# Altium schematic sheet obc-v2_FRAM-FLASH.SchDoc
size 420 x 297 mm; SheetNumber: 8; SheetTotal: 23
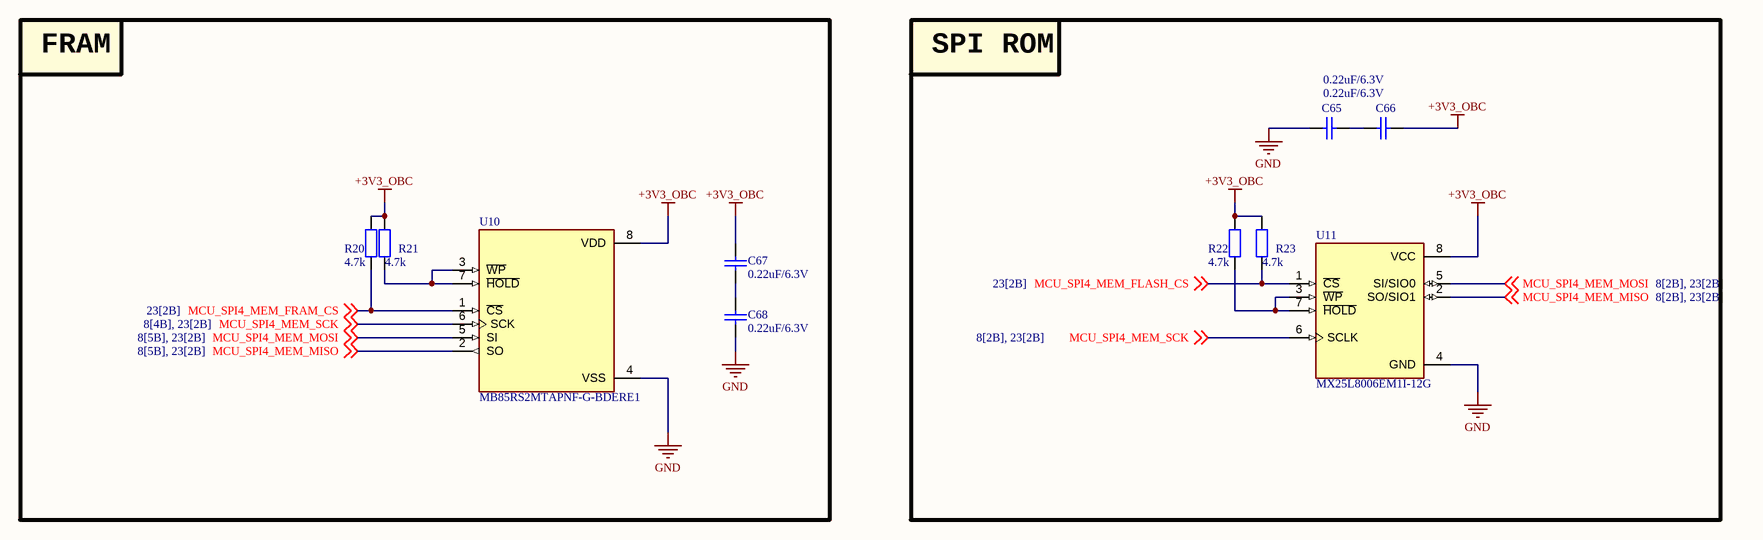
[diagram p0: obc-v2_FRAM-FLASH.SchDoc]

## Parts
C65  0.22uF/6.3V  [CAP_C_1005X60]
C66  0.22uF/6.3V  [CAP_C_1005X60]
C67  0.22uF/6.3V  [CAP_C_1005X60]
C68  0.22uF/6.3V  [CAP_C_1005X60]
R20  4.7k  [RES_C_1608X60]
R21  4.7k  [RES_C_1608X60]
R22  4.7k  [RES_C_1608X60]
R23  4.7k  [RES_C_1608X60]
U10  MB85RS2MTAPNF-G-BDERE1  [SOIC127P602X173-8N]
U11  MX25L8006EM1I-12G  [SOIC127P602X173-8N]

## Blocks framed on the sheet
FRAM: C67 C68 R20 R21 U10
SPI ROM: C65 C66 R22 R23 U11

## Nets
+3V3_OBC: C66.1 C67.1 R20.2 R21.2 R22.2 R23.2 U10.8(VDD) U11.8(VCC)
GND: C65.2 C68.1 U10.4(VSS) U11.4(GND)
MCU_SPI4_MEM_FLASH_CS: R23.1 U11.1(~{CS}) ; off-sheet MCU_SPI4_MEM_FLASH_CS
MCU_SPI4_MEM_FRAM_CS: R20.1 U10.1(~{CS}) ; off-sheet MCU_SPI4_MEM_FRAM_CS
MCU_SPI4_MEM_MISO: U10.2(SO) U11.2(SO/SIO1) ; off-sheet MCU_SPI4_MEM_MISO
MCU_SPI4_MEM_MOSI: U10.5(SI) U11.5(SI/SIO0) ; off-sheet MCU_SPI4_MEM_MOSI
MCU_SPI4_MEM_SCK: U10.6(SCK) U11.6(SCLK) ; off-sheet MCU_SPI4_MEM_SCK
NetC65_1: C65.1 C66.2
NetC67_2: C67.2 C68.2
NetR21_1: R21.1 U10.3(~{WP}) U10.7(~{HOLD})
NetR22_1: R22.1 U11.3(~{WP}) U11.7(~{HOLD})

## Notes on the sheet
- Project:
- Sub-system:
- Design by:
- Sheet title:
- Sheet
- A3
- of
- Checked by:
- Approved by:
- Revision:
- Document No:
- Size:
- Date:

## Library data of the parts
C65-C68 = Tu 0402 33nF 10V: CAPC; Chung_Loai: Dán; Don_Vi: Con; So_Chan: 2; Ten_Linh_Kien: Tụ 0402 33nF X7R 10V GRM155R71A333KA01D; Ma_Hang: MH007853; Kieu_Chan: *
R20-R23 = Tro 0603 1% 10k: RES; Chung_Loai: Dán; Don_Vi: Con; So_Chan: 2; Ten_Linh_Kien: Trở 0603 1% 10k; Ma_Hang: MH006333; Kieu_Chan: *
U10 = MB85RS2MTAPNF-G-BDERE1: FRAM _Ferroelectric RAM_ Memory IC 2Mb _256K x 8_ SPI 40MHz 8-SOP; MF: Fujitsu Electronics; Package: SO-8 Fujitsu; Value: *; Digi-Key_Purchase_URL: https://www.digikey.com/product-detail/en/fujitsu-electronics-america-inc/MB85RS2MTAPNF-G-BDERE1/865-1286-1-ND/7916252?utm_source=snapeda&utm_medium=aggregator&utm_campaign=symbol; Digi-Key_Part_Number: 865-1286-1-ND; SnapEDA_Link: https://www.snapeda.com/parts/MB85RS2MTAPNF-G-BDERE1/Fujitsu%20Electronics%20America%2C%20Inc./view-part/2344795/?ref=snap; MP: MB85RS2MTAPNF-G-BDERE1
U11 = MX25L8006EM1I-12G: FLASH - NOR Memory IC 8Mb (1M x 8) SPI 86 MHz 8-SOP; MF: Macronix; SnapEDA_Link: https://www.snapeda.com/parts/MX25L8006EM1I-12G/Macronix/view-part/?ref=snap; Package: SOP-8 Macronix; Value: *; MP: MX25L8006EM1I-12G; Check_prices: https://www.snapeda.com/parts/MX25L8006EM1I-12G/Macronix/view-part/?ref=eda